# Altium schematic sheet Buffers.schdoc
size A; SheetNumber: 3; SheetTotal: 5
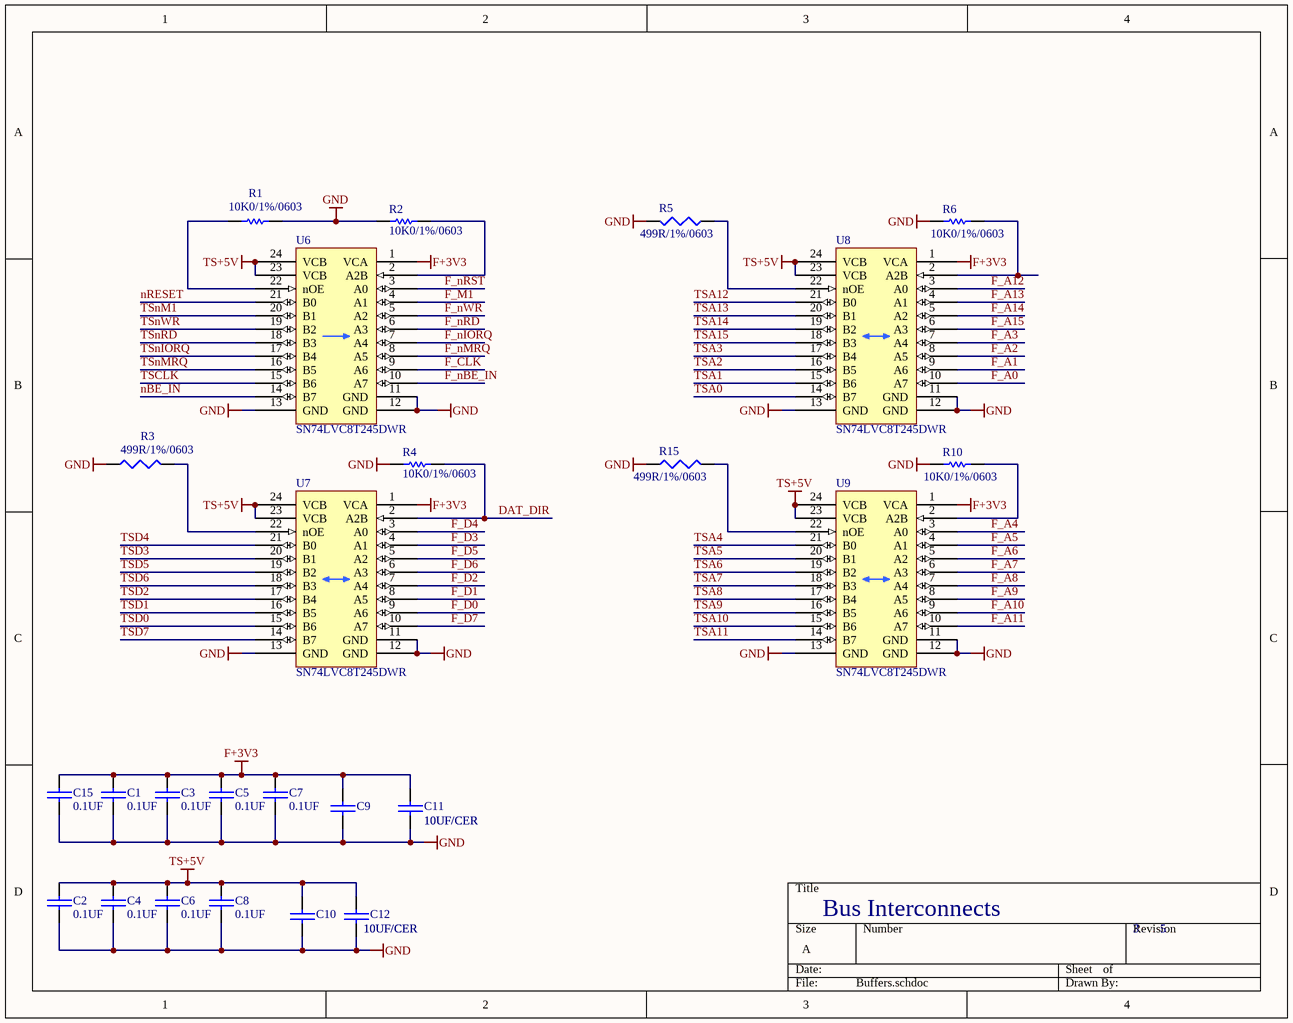
[diagram p0: Buffers.schdoc]

## Parts
C1  0.1UF  [0603]
C2  0.1UF  [0603]
C3  0.1UF  [0603]
C4  0.1UF  [0603]
C5  0.1UF  [0603]
C6  0.1UF  [0603]
C7  0.1UF  [0603]
C8  0.1UF  [0603]
C9  10UF/CER  [0805]
C10  10UF/CER  [0805]
C11  10UF/CER  [0805]
C12  10UF/CER  [0805]
C15  0.1UF  [0603]
R1  10K0/1%/0603  [0603]
R2  10K0/1%/0603  [0603]
R3  499R/1%/0603  [0603]
R4  10K0/1%/0603  [0603]
R5  499R/1%/0603  [0603]
R6  10K0/1%/0603  [0603]
R10  10K0/1%/0603  [0603]
R15  499R/1%/0603  [0603]
U6  SN74LVC8T245DWR  [SOL-24]
U7  SN74LVC8T245DWR  [SOL-24]
U8  SN74LVC8T245DWR  [SOL-24]
U9  SN74LVC8T245DWR  [SOL-24]

## Nets
F+3V3: C1.1 C3.1 C5.1 C7.1 C9.1 C11.1 C15.1 U6.1(VCA) U7.1(VCA) U8.1(VCA) U9.1(VCA)
GND: C1.2 C2.2 C3.2 C4.2 C5.2 C6.2 C7.2 C8.2 C9.2 C10.2 C11.2 C12.2 C15.2 R1.1 R2.1 R3.1 R4.1 R5.2 R6.1 R10.1 R15.1 U6.11(GND) U6.12(GND) U6.13(GND) U7.11(GND) U7.12(GND) U7.13(GND) U8.11(GND) U8.12(GND) U8.13(GND) U9.11(GND) U9.12(GND) U9.13(GND)
TS+5V: C2.1 C4.1 C6.1 C8.1 C10.1 C12.1 U6.23(VCB) U6.24(VCB) U7.23(VCB) U7.24(VCB) U8.23(VCB) U8.24(VCB) U9.23(VCB) U9.24(VCB)
DAT_DIR: R4.2 U7.2(A2B)
F_A0: U8.10(A7)
F_A1: U8.9(A6)
F_A2: U8.8(A5)
F_A3: U8.7(A4)
F_A4: U9.3(A0)
F_A5: U9.4(A1)
F_A6: U9.5(A2)
F_A7: U9.6(A3)
F_A8: U9.7(A4)
F_A9: U9.8(A5)
F_A10: U9.9(A6)
F_A11: U9.10(A7)
F_A12: U8.3(A0)
F_A13: U8.4(A1)
F_A14: U8.5(A2)
F_A15: U8.6(A3)
F_CLK: U6.9(A6)
F_D0: U7.9(A6)
F_D1: U7.8(A5)
F_D2: U7.7(A4)
F_D3: U7.4(A1)
F_D4: U7.3(A0)
F_D5: U7.5(A2)
F_D6: U7.6(A3)
F_D7: U7.10(A7)
F_M1: U6.4(A1)
F_nBE_IN: U6.10(A7)
F_nIORQ: U6.7(A4)
F_nMRQ: U6.8(A5)
F_nRD: U6.6(A3)
F_nRST: U6.3(A0)
F_nWR: U6.5(A2)
nBE_IN: U6.14(B7)
nRESET: U6.21(B0)
TSA0: U8.14(B7)
TSA1: U8.15(B6)
TSA2: U8.16(B5)
TSA3: U8.17(B4)
TSA4: U9.21(B0)
TSA5: U9.20(B1)
TSA6: U9.19(B2)
TSA7: U9.18(B3)
TSA8: U9.17(B4)
TSA9: U9.16(B5)
TSA10: U9.15(B6)
TSA11: U9.14(B7)
TSA12: U8.21(B0)
TSA13: U8.20(B1)
TSA14: U8.19(B2)
TSA15: U8.18(B3)
TSCLK: U6.15(B6)
TSD0: U7.15(B6)
TSD1: U7.16(B5)
TSD2: U7.17(B4)
TSD3: U7.20(B1)
TSD4: U7.21(B0)
TSD5: U7.19(B2)
TSD6: U7.18(B3)
TSD7: U7.14(B7)
TSnIORQ: U6.17(B4)
TSnM1: U6.20(B1)
TSnMRQ: U6.16(B5)
TSnRD: U6.18(B3)
TSnWR: U6.19(B2)
NetR1_2: R1.2 U6.22(nOE)
NetR2_2: R2.2 U6.2(A2B)
NetR3_2: R3.2 U7.22(nOE)
NetR5_1: R5.1 U8.22(nOE)
NetR6_2: R6.2 U8.2(A2B)
NetR10_2: R10.2 U9.2(A2B)
NetR15_2: R15.2 U9.22(nOE)

## Notes on the sheet
- Bus Interconnects

## Library data of the parts
C1-C8 C15 = 0.1UF: CAP .10UF 16V CERAMIC X7R 0603; MFG: Kemet; MFG PN: C0603C104K4RACTU; DK PN: 399-1096-1-ND; Price: 1.17
C9-C12 = 10UF/CER: 10µF ±10% 25V Ceramic Capacitor X7S 0805; MFG: Murata; MFG PN: GRM21BC71E106KE11L; DK PN: 490-10496-1-ND
R1 R2 R4 R6 R10 = RES10K0: 10k Ohm ±1% 0.1W, 1/10W Chip Resistor 0603 (1608 Metric) Moisture Resistant Thick Film; MFG PN: RC0603FR-0710KL; DK PN: 311-10.0KHRTR-ND; MFG: Yageo; Populate: *
R3 R5 R15 = 499R/1%/0603: 499 Ohms ±1% 0.1W, 1/10W Chip Resistor 0603 (1608 Metric) Moisture Resistant Thick Film; MFG: Yeago; MFG PN: RC0603FR-07499RL; DK PN: 311-499HRCT-ND
U6-U9 = SN74LVC8T245DWR: Voltage Level Translator Bidirectional 1 Circuit 8 Channel 24-SOIC; MFG: TI; DK PN: 296-23280-1-ND; MFG PN: SN74LVC8T245DWR; Price: 1.02